# EasyEDA Pro project compute-module-v101.eprj, schematic base-board-5x
Board Name: base-board; Create Date: 2025-09-19; Page Name: P1; Project Name: compute-module-v101; Schematic Name: base-board; Update Date: 2025-12-01; Company: EasyEDA.com; Page Size: A4; Version: V1.0
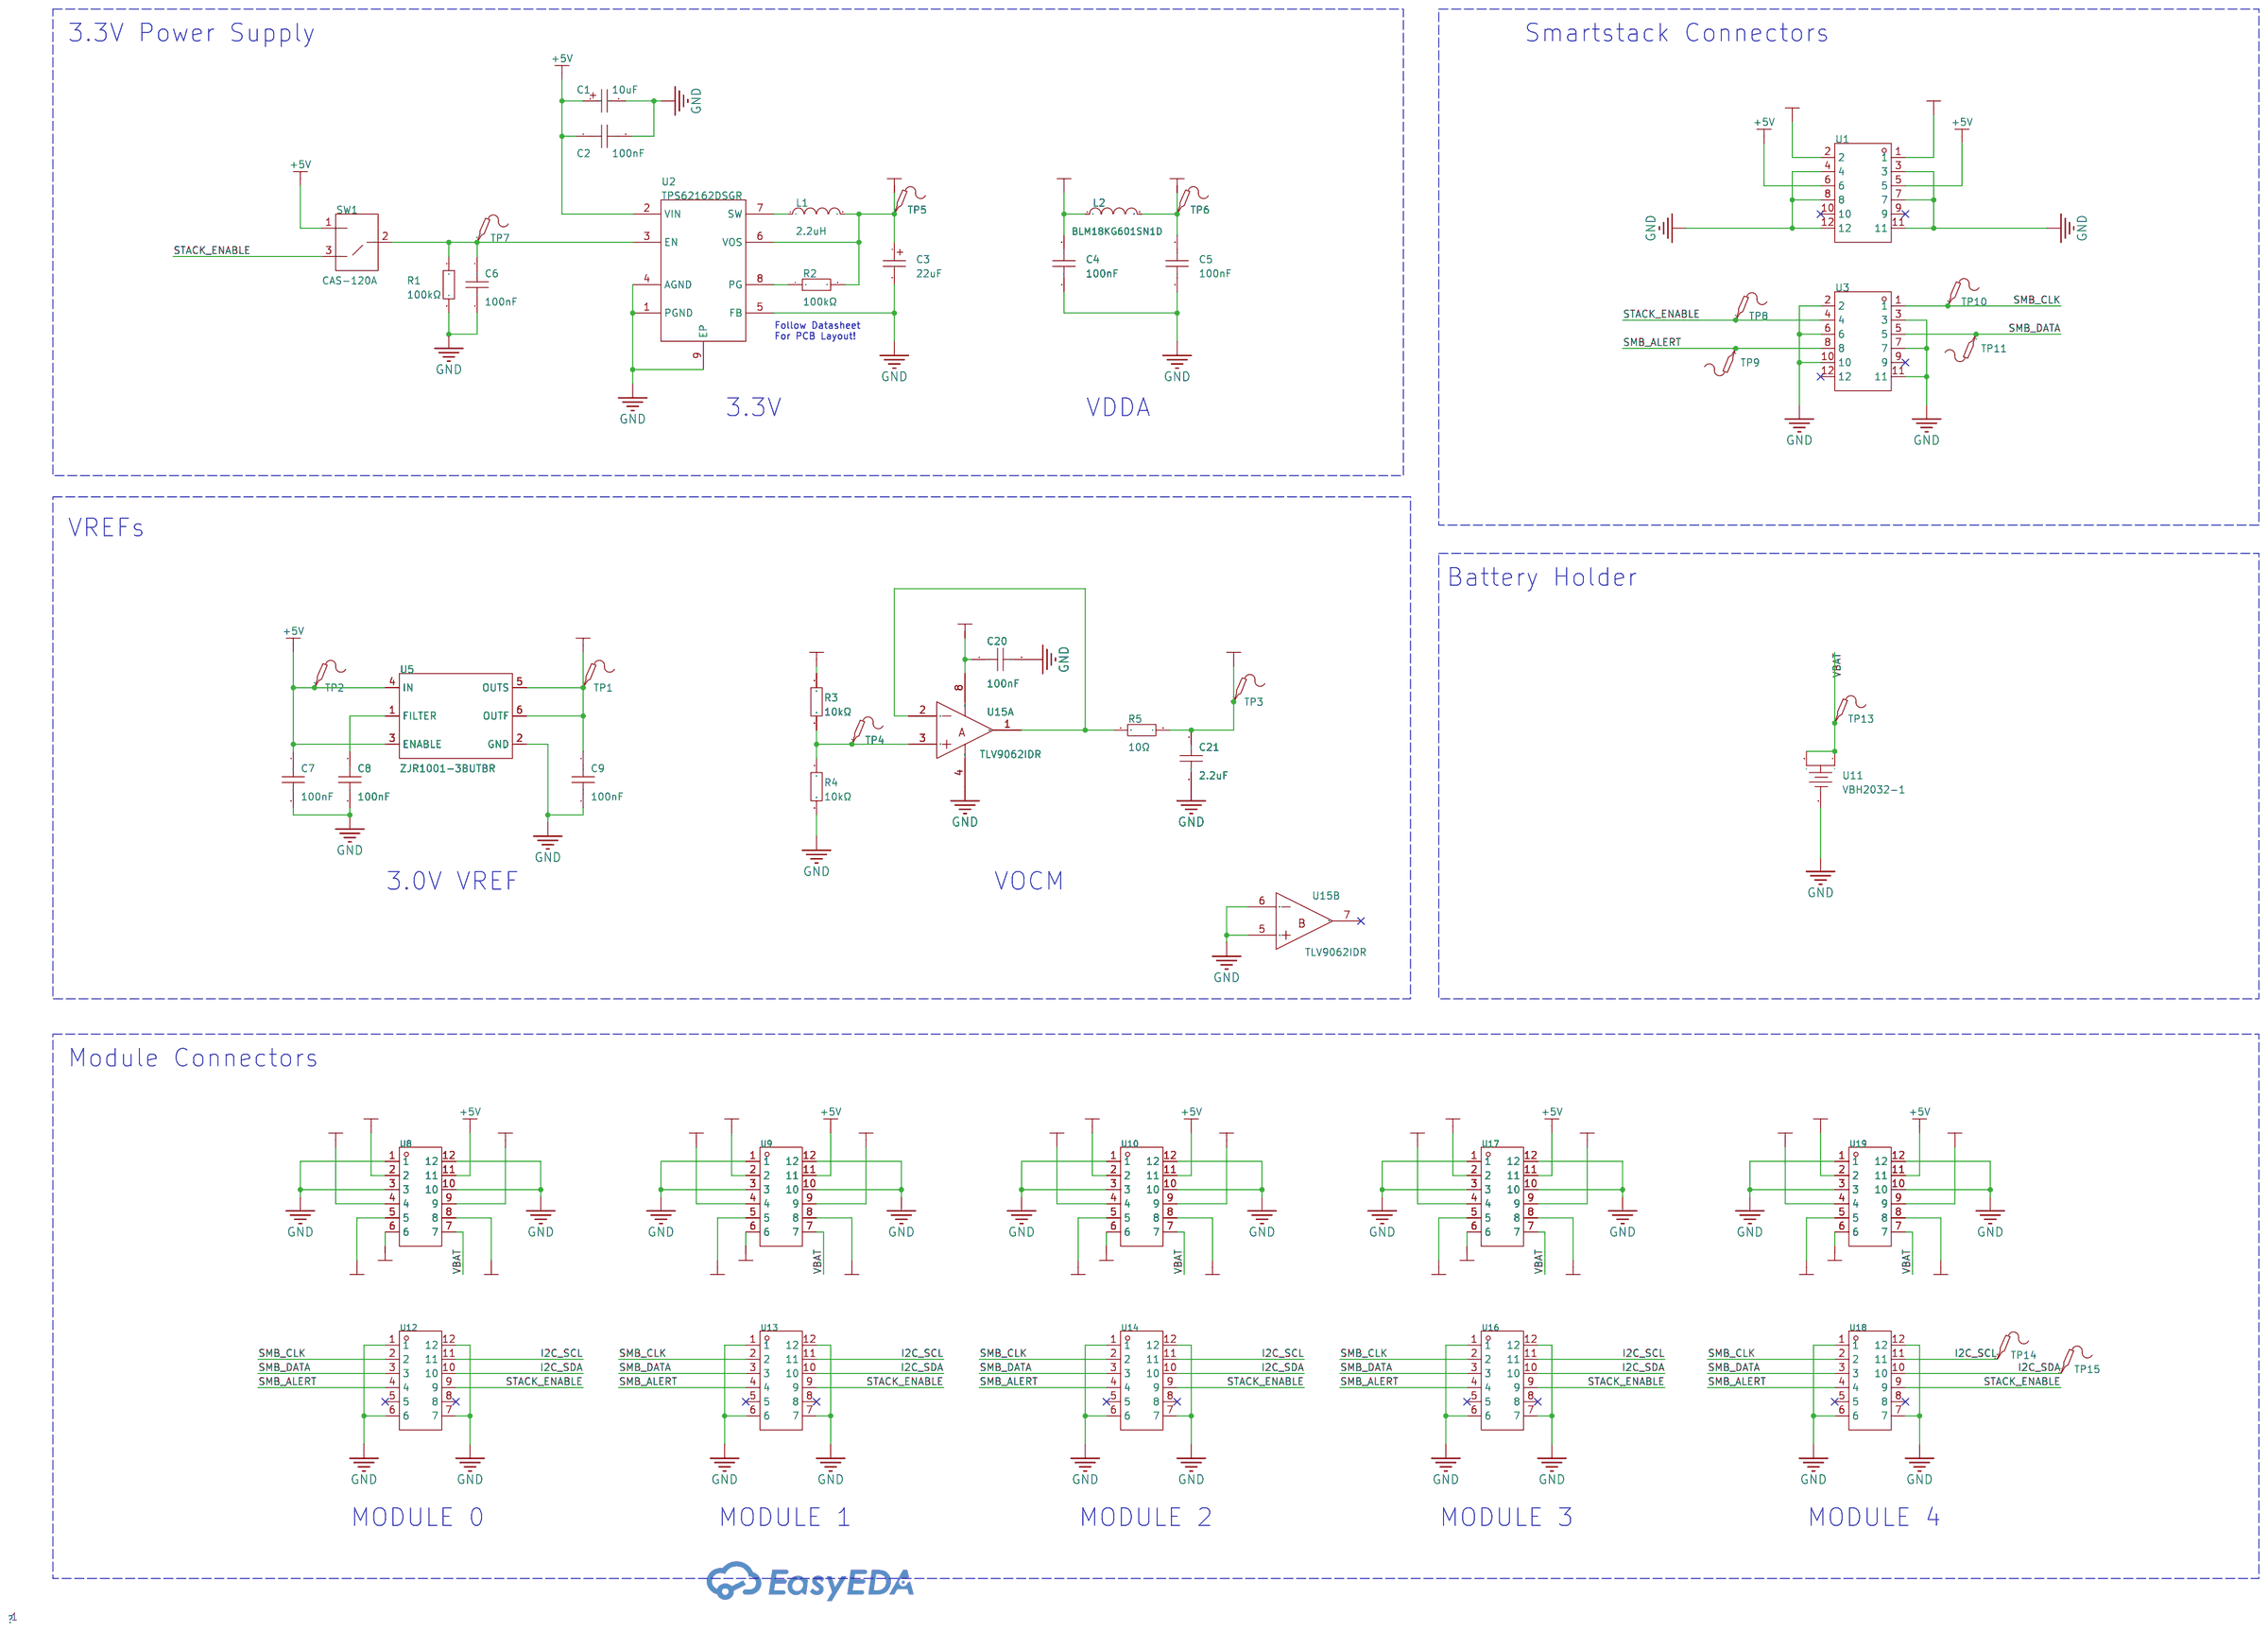
[diagram p0: schematic sheet]

## Parts
C1  10uF  [C0805]
C2  100nF  [C0603]
C3  22uF  [C1206]
C4  100nF  [C0603]
C5  100nF  [C0603]
C6  100nF  [C0603]
C7  100nF  [C0603]
C8  100nF  [C0603]
C9  100nF  [C0603]
C20  100nF  [C0603]
C21  2.2uF  [C0603]
L1  2.2uH  [IND-SMD_L2.0-W1.6-1]
L2  BLM18KG601SN1D  [L0603]
R1  100kΩ  [R0603]
R2  100kΩ  [R0603]
R3  10kΩ  [R0603]
R4  10kΩ  [R0603]
R5  10Ω  [R0603]
SW1  CAS-120A  [SW-SMD_CAS-120A]
TP1  -  [Test-Point-0.5mm]
TP2  -  [Test-Point-0.5mm]
TP3  -  [Test-Point-0.5mm]
TP4  -  [Test-Point-0.5mm]
TP5  -  [Test-Point-0.5mm]
TP6  -  [Test-Point-0.5mm]
TP7  -  [Test-Point-0.5mm]
TP8  -  [Test-Point-0.5mm]
TP9  -  [Test-Point-0.5mm]
TP10  -  [Test-Point-0.5mm]
TP11  -  [Test-Point-0.5mm]
TP13  -  [Test-Point-0.5mm]
TP14  -  [Test-Point-0.5mm]
TP15  -  [Test-Point-0.5mm]
U1  2005FV-2x6P  [HDR-TH_12P-P2.00-V-F-R2-C6-S2.00]
U2  TPS62162DSGR  [WSON-8_L2.0-W2.0-P0.50-TL-EP]
U3  2005FV-2x6P  [HDR-TH_12P-P2.00-V-F-R2-C6-S2.00]
U5  ZJR1001-3BUTBR  [SOT-23-6_L2.9-W1.6-P0.95-LS2.9-BL]
U8  ED12BGFBK  [CONN-TH_12P-P2.54_WINGTAT_ED12BGFBK]
U9  ED12BGFBK  [CONN-TH_12P-P2.54_WINGTAT_ED12BGFBK]
U10  ED12BGFBK  [CONN-TH_12P-P2.54_WINGTAT_ED12BGFBK]
U11  VBH2032-1  [BAT-TH_3P-L23.0-W6.0_VBH2032-1]
U12  ED12BGFBK  [CONN-TH_12P-P2.54_WINGTAT_ED12BGFBK]
U13  ED12BGFBK  [CONN-TH_12P-P2.54_WINGTAT_ED12BGFBK]
U14  ED12BGFBK  [CONN-TH_12P-P2.54_WINGTAT_ED12BGFBK]
U15  TLV9062IDR  [SOIC-8_L5.0-W4.0-P1.27-LS6.0-BL]  (sections 1,2)
U16  ED12BGFBK  [CONN-TH_12P-P2.54_WINGTAT_ED12BGFBK]
U17  ED12BGFBK  [CONN-TH_12P-P2.54_WINGTAT_ED12BGFBK]
U18  ED12BGFBK  [CONN-TH_12P-P2.54_WINGTAT_ED12BGFBK]
U19  ED12BGFBK  [CONN-TH_12P-P2.54_WINGTAT_ED12BGFBK]

## Library data of the parts
C1 = CL21A106KAYNNNE_C15850: Capacitance:10uF Tolerance:±10% Tolerance:±10% Voltage Rating:25V Temperature Coefficient:X5R; LCSC Part Name: 10uF ±10% 25V; Supplier Part: C15850; Manufacturer: SAMSUNG(三星); Manufacturer Part: CL21A106KAYNNNE; Supplier Footprint: 0805; JLCPCB Part Class: Basic Part; Datasheet: https://item.szlcsc.com/datasheet/CL21A106KAYNNNE/16532.html; Supplier: LCSC; Tolerance: ±10%; Voltage Rating: 25V; Temperature Coefficient: X5R
C2 C4-C9 C20 = CC0603KRX7R9BB104: Capacitance:100nF Tolerance:±10% Tolerance:±10% Voltage Rating:50V Temperature Coefficient:X7R; LCSC Part Name: 100nF ±10% 50V; Supplier Part: C14663; Manufacturer: YAGEO(国巨); Supplier Footprint: 0603; JLCPCB Part Class: Basic Part; Datasheet: https://item.szlcsc.com/datasheet/CC0603KRX7R9BB104/15331.html; Supplier: LCSC; Tolerance: ±10%; Voltage Rating: 50V; Temperature Coefficient: X7R
C3 = CL31A226KAHNNNE: Capacitance:22uF Tolerance:±10% Tolerance:±10% Voltage Rating:25V Temperature Coefficient:X5R; LCSC Part Name: 22uF ±10% 25V; Supplier Part: C12891; Manufacturer: SAMSUNG(三星); Supplier Footprint: 1206; JLCPCB Part Class: Basic Part; Datasheet: https://item.szlcsc.com/datasheet/CL31A226KAHNNNE/13537.html; Supplier: LCSC; Tolerance: ±10%; Voltage Rating: 25V; Temperature Coefficient: X5R
C21 = CL10A225KO8NNNC: Capacitance:2.2uF Tolerance:±10% Tolerance:±10% Voltage Rating:16V Temperature Coefficient:X5R; LCSC Part Name: 2.2uF ±10% 16V; Supplier Part: C23630; Manufacturer: SAMSUNG(三星); Supplier Footprint: 0603; JLCPCB Part Class: Basic Part; Datasheet: https://item.szlcsc.com/datasheet/CL10A225KO8NNNC/24366.html; Supplier: LCSC; Tolerance: ±10%; Voltage Rating: 16V; Temperature Coefficient: X5R
L1 = TFM201610ALMA2R2MTAA: Inductance: Tolerance:±20% Tolerance:±20% Rated Current: Saturation Current (Isat): DC Resistance (DCR): Q @ Freq:- Frequency - Self Resonant:- Ratings:AEC-Q200; LCSC Part Name: 2.2uH ±20% 2A; Supplier Part: C404810; Manufacturer: TDK; Supplier Footprint: SMD,1.6x2mm; JLCPCB Part Class: Extended Part; Datasheet: https://atta.szlcsc.com/upload/public/pdf/source/20190717/C404810_ABF5B38A636D8F3C7C774ECB5D7697CD.pdf; Supplier: LCSC; Tolerance: ±20%; Ratings: AEC-Q200
L2 = BLM18KG601SN1D: Impedance @ Frequency:600Ω@100MHz Tolerance:±25% Tolerance:±25% DC Resistance(DCR):150mΩ Current Rating:1.3A Number of Circuits:1 Operating Temperature:-55℃~+125℃ Operating Temperature:-55℃~+125℃; LCSC Part Name: 单路 0603磁珠 阻抗600Ω@100MHz; Supplier Part: C85833; Manufacturer: muRata(村田); Supplier Footprint: 0603; JLCPCB Part Class: Extended Part; Datasheet: https://item.szlcsc.com/datasheet/BLM18KG601SN1D/87009.html; Supplier: LCSC; Impedance @ Frequency: 600Ω@100MHz; Tolerance: ±25%; DC Resistance(DCR): 150mΩ; Current Rating: 1.3A; Number of Circuits: 1; Operating Temperature: -55℃~+125℃
R1 R2 = 0603WAF1003T5E: Type:Thick Film Resistor Resistance:100kΩ Tolerance:±1% Tolerance:±1% Power(Watts):100mW Voltage-Supply(Max):75V Temperature Coefficient:±100ppm/℃ Temperature Coefficient:±100ppm/℃ Operating Temperature:-55℃~+155℃ Operating Temperature:-55℃~+155℃; LCSC Part Name: 100kΩ ±1% 100mW 厚膜电阻; Supplier Part: C25803; Manufacturer: UNI-ROYAL(厚声); Supplier Footprint: 0603; JLCPCB Part Class: Basic Part; Datasheet: https://item.szlcsc.com/datasheet/0603WAF1003T5E/26546.html; Supplier: LCSC; Type: Thick Film Resistor; Tolerance: ±1%; Power(Watts): 100mW; Voltage-Supply(Max): 75V; Temperature Coefficient: ±100ppm/℃; Operating Temperature: -55℃~+155℃
R3 R4 = RT0603BRD0710KL: Type:Thin Film Resistor Resistance:10kΩ Tolerance:±0.1% Tolerance:±0.1% Power(Watts):100mW Voltage-Supply(Max):75V Temperature Coefficient:±25ppm/℃ Temperature Coefficient:±25ppm/℃ Operating Temperature:-55℃~+155℃ Operating Temperature:-55℃~+155℃; LCSC Part Name: 薄膜电阻 10kΩ ±0.1% 100mW; Supplier Part: C95204; Manufacturer: YAGEO(国巨); Supplier Footprint: 0603; JLCPCB Part Class: Extended Part; Datasheet: https://item.szlcsc.com/datasheet/RT0603BRD0710KL/96405.html; Supplier: LCSC; Type: Thin Film Resistor; Tolerance: ±0.1%; Power(Watts): 100mW; Voltage-Supply(Max): 75V; Temperature Coefficient: ±25ppm/℃; Operating Temperature: -55℃~+155℃
R5 = 0603WAF100JT5E: Type:Thick Film Resistor Resistance:10Ω Tolerance:±1% Tolerance:±1% Power(Watts):100mW Voltage-Supply(Max):75V Temperature Coefficient:±400ppm/℃ Temperature Coefficient:±400ppm/℃ Operating Temperature:-55℃~+155℃ Operating Temperature:-55℃~+155℃; LCSC Part Name: 10Ω ±1% 100mW 厚膜电阻; Supplier Part: C22859; Manufacturer: UNI-ROYAL(厚声); Supplier Footprint: 0603; JLCPCB Part Class: Basic Part; Datasheet: https://item.szlcsc.com/datasheet/0603WAF100JT5E/23586.html; Supplier: LCSC; Type: Thick Film Resistor; Tolerance: ±1%; Power(Watts): 100mW; Voltage-Supply(Max): 75V; Temperature Coefficient: ±400ppm/℃; Operating Temperature: -55℃~+155℃
SW1 = CAS-120A: Circuit:SPDT Actuator Style:- Termination Style:J-Lead Mounting Type:Surface Mount,Vertical Voltage Rating:6V Operating Temperature:-40℃~+85℃ Operating Temperature:-40℃~+85℃; Supplier Part: C5962834; Manufacturer: NIDEC(尼得科); JLCPCB Part Class: Extended Part; Datasheet: https://item.szlcsc.com/datasheet/CAS-120A/6900877.html; Supplier: LCSC; Circuit: SPDT; Termination Style: J-Lead; Mounting Type: Surface Mount,Vertical; Voltage Rating: 6V; Operating Temperature: -40℃~+85℃
TP1-TP11 TP13-TP15 = Test-Point
U1 U3 = 2005FV-2x6P: Holes Structure:2x6P Pitch:2mm Row Spacing:2mm Circular Hole / Square Hole:Square Hole Mounting Type:Through Hole Number of Rows:2 Number of Positions:12P Current Rating:2A Holes Direction:Top Insulation Height:4.3mm Operating Temperature:-40℃~+105℃ Opera; LCSC Part Name: 间距:2mm 2x6P 直插; Supplier Part: C18723068; Manufacturer: HanElectricity(瀚源); Supplier Footprint: 插件,P=2mm; JLCPCB Part Class: Extended Part; Datasheet: https://item.szlcsc.com/datasheet/2005FV-2x6P/19915672.html; Supplier: LCSC; Holes Structure: 2x6P; Pitch: 2mm; Row Spacing: 2mm; Circular Hole / Square Hole: Square Hole; Mounting Type: Through Hole; Number of Rows: 2; Number of Positions: 12P; Current Rating: 2A; Holes Direction: Top; Insulation Height: 4.3mm; Operating Temperature: -40℃~+105℃
U2 = TPS62162DSGR: Function:Step-down type Output Type:- Voltage - Supply:3V~17V Voltage - Supply:3V~17V Output Voltage:- Output Voltage:- Output Current:1A Frequency - Switching:2.25MHz Frequency - Switching:2.25MHz Operating Temperature:-40℃~+125℃@(TJ) Operating Temperatu; LCSC Part Name: TPS62162DSGR同步降压DC-DC转换器; Supplier Part: C40256; Manufacturer: TI(德州仪器); Supplier Footprint: WSON-8-EP(2x2); JLCPCB Part Class: Extended Part; Datasheet: https://www.ti.com/cn/lit/gpn/tps62162; Supplier: LCSC; Function: Step-down type; Voltage - Supply: 3V~17V; Output Current: 1A; Frequency - Switching: 2.25MHz; Operating Temperature: -40℃~+125℃@(TJ); Synchronous Rectifier: Yes; Number of Outputs: 1; Topology: Step-down; Switch tube (built-in/external): Built-in
U5 = ZJR1001-3BUTBR: LCSC Part Name: 低噪声、低温漂、精密电压基准源 输出电压:3V 最大温度系数:5ppm/°C 供电电压:3.3至5.5V 供电电流:130µA  温度范围:-40°C至125°C; Supplier Part: C22374129; Manufacturer: 治精微; Supplier Footprint: SOT-23-6; JLCPCB Part Class: Extended Part; Datasheet: https://item.szlcsc.com/datasheet/ZJR1001-3BUTBR/23871283.html; Supplier: LCSC; Output Type: Fixed; Voltage - Supply: 3.3V~5.5V; Output Voltage: 3V; Output Current: 10mA; Tolerance: ±0.05%; Temperature Coefficient: 5ppm/℃; Quiescent Current: 130uA; Noise - 1/10Hz to 10Hz: 2.5ppmp-p; Operating Temperature: -40℃~+125℃
U8-U10 U12-U14 U16-U19 = ED12BGFBK: Connector Type:EDGE SLOT Pitch:2.54mm Number of Pins:12P Mounting Type:Through Hole Height Above Board:15.6mm Contact Material:Copper Alloy Contact Plating:Gold Operating Temperature:-55℃~+125℃ Operating Temperature:-55℃~+125℃; LCSC Part Name: 2.54mm P数:12P; Supplier Part: C5173290; Manufacturer: WingTAT(格林柏); Supplier Footprint: 插件,P=2.54mm; JLCPCB Part Class: Extended Part; Datasheet: https://item.szlcsc.com/datasheet/ED12BGFBK/5822873.html; Supplier: LCSC; Connector Type: EDGE SLOT; Pitch: 2.54mm; Number of Pins: 12P; Mounting Type: Through Hole; Height Above Board: 15.6mm; Contact Material: Copper Alloy; Contact Plating: Gold; Operating Temperature: -55℃~+125℃
U11 = VBH2032-1: Supplier Part: C19091283; Manufacturer: RENATA(瑞纳达); JLCPCB Part Class: Extended Part; Supplier: LCSC
U15 = TLV9062IDR: LCSC Part Name: 适用于成本敏感型系统的10MHz、轨到轨输入输出（RRIO）CMOS运算放大器; Supplier Part: C398355; Manufacturer: TI(德州仪器); Supplier Footprint: SOIC-8; JLCPCB Part Class: Extended Part; Datasheet: https://www.ti.com/cn/lit/gpn/tlv9061; Supplier: LCSC; Number of Channels: 2; Maximum Power Supply Range (Vdd-Vss): 9V; Vos - Input Offset Voltage: 1.6mV; Input Offset Voltage Drift(Vos TC): 0.53uV/℃; Slew Rate: 6.5V/us; Ib - Input Bias Current: 0.5pA; Noise density(eN): 10nV/√Hz@1kHz; Common Mode Rejection Ratio(CMRR): 103dB; Operating Temperature: -40℃~+125℃; Single supply: 1.8V~5.5V

## Nets
+3V3: C3.1 C4.2 L1.2 L2.1 R2.2 TP5.1 U2.6(VOS) U8.4 U8.9 U9.4 U9.9 U10.4 U10.9 U17.4 U17.9 U19.4 U19.9
+5V: C1.1 C2.1 C7.1 SW1.1 TP2.1 U1.5 U1.6 U2.2(VIN) U5.3(ENABLE) U5.4(IN) U8.11 U9.11 U10.11 U17.11 U19.11
+12V: U1.1 U1.2 U8.2 U9.2 U10.2 U17.2 U19.2
GND: C1.2 C2.2 C3.2 C4.1 C5.1 C6.2 C7.2 C8.2 C9.2 C20.2 C21.2 R1.2 R4.2 U1.3 U1.4 U1.7 U1.8 U1.11 U1.12 U2.1(PGND) U2.4(AGND) U2.5(FB) U2.9(EP) U3.2 U3.3 U3.6 U3.7 U3.10 U3.11 U5.2(GND) U8.1 U8.3 U8.10 U8.12 U9.1 U9.3 U9.10 U9.12 U10.1 U10.3 U10.10 U10.12 U11.3(-) U12.1 U12.6 U12.7 U12.12 U13.1 U13.6 U13.7 U13.12 U14.1 U14.6 U14.7 U14.12 U15.4(VEE/GND) U15.5(INB+) U15.6(INB-) U16.1 U16.6 U16.7 U16.12 U17.1 U17.3 U17.10 U17.12 U18.1 U18.6 U18.7 U18.12 U19.1 U19.3 U19.10 U19.12
VBAT: TP13.1 U8.7 U9.7 U10.7 U11.1(+) U11.2(+) U17.7 U19.7
VDDA: C5.2 C20.1 L2.2 TP6.1 U8.5 U9.5 U10.5 U15.8(VCC) U17.5 U19.5
I2C_SCL: TP14.1 U12.11 U13.11 U14.11 U16.11 U18.11
I2C_SDA: TP15.1 U12.10 U13.10 U14.10 U16.10 U18.10
SMB_ALERT: TP9.1 U3.8 U12.4 U13.4 U14.4 U16.4 U18.4
SMB_CLK: TP10.1 U3.1 U12.2 U13.2 U14.2 U16.2 U18.2
SMB_DATA: TP11.1 U3.5 U12.3 U13.3 U14.3 U16.3 U18.3
STACK_ENABLE: SW1.3 TP8.1 U3.4 U12.9 U13.9 U14.9 U16.9 U18.9
VOCM: C21.1 R5.2 TP3.1 U8.8 U9.8 U10.8 U17.8 U19.8
VREF: C9.1 R3.1 TP1.1 U5.5(OUTS) U5.6(OUTF) U8.6 U9.6 U10.6 U17.6 U19.6
$1N831: L1.1 U2.7(SW)
$1N832: R2.1 U2.8(PG)
$1N837: C6.1 R1.1 SW1.2(C) TP7.1 U2.3(EN)
$1N8820: C8.1 U5.1(FILTER)
$1N10873: R3.2 R4.1 TP4.1 U15.3(INA+)
$1N12732: R5.1 U15.1(OUTA) U15.2(INA-)

Not connected (* = marked no-connect by the designer): U1 9* 10*; U3 9* 12*; U12 5* 8*; U13 5* 8*; U14 5* 8*; U15 7(OUTB)*; U16 5* 8*; U18 5* 8*

## Notes on the sheet
- 3.3V Power Supply
- Smartstack Connectors
- Follow Datasheet
  For PCB Layout!
- 3.3V
- VDDA
- VREFs
- Battery Holder
- 3.0V VREF
- VOCM
- Module Connectors
- MODULE 0
- MODULE 1
- MODULE 2
- MODULE 3
- MODULE 4
